# Altium schematic sheet 00Structure.SchDoc
size A3; SheetNumber: 0; SheetTotal: 1
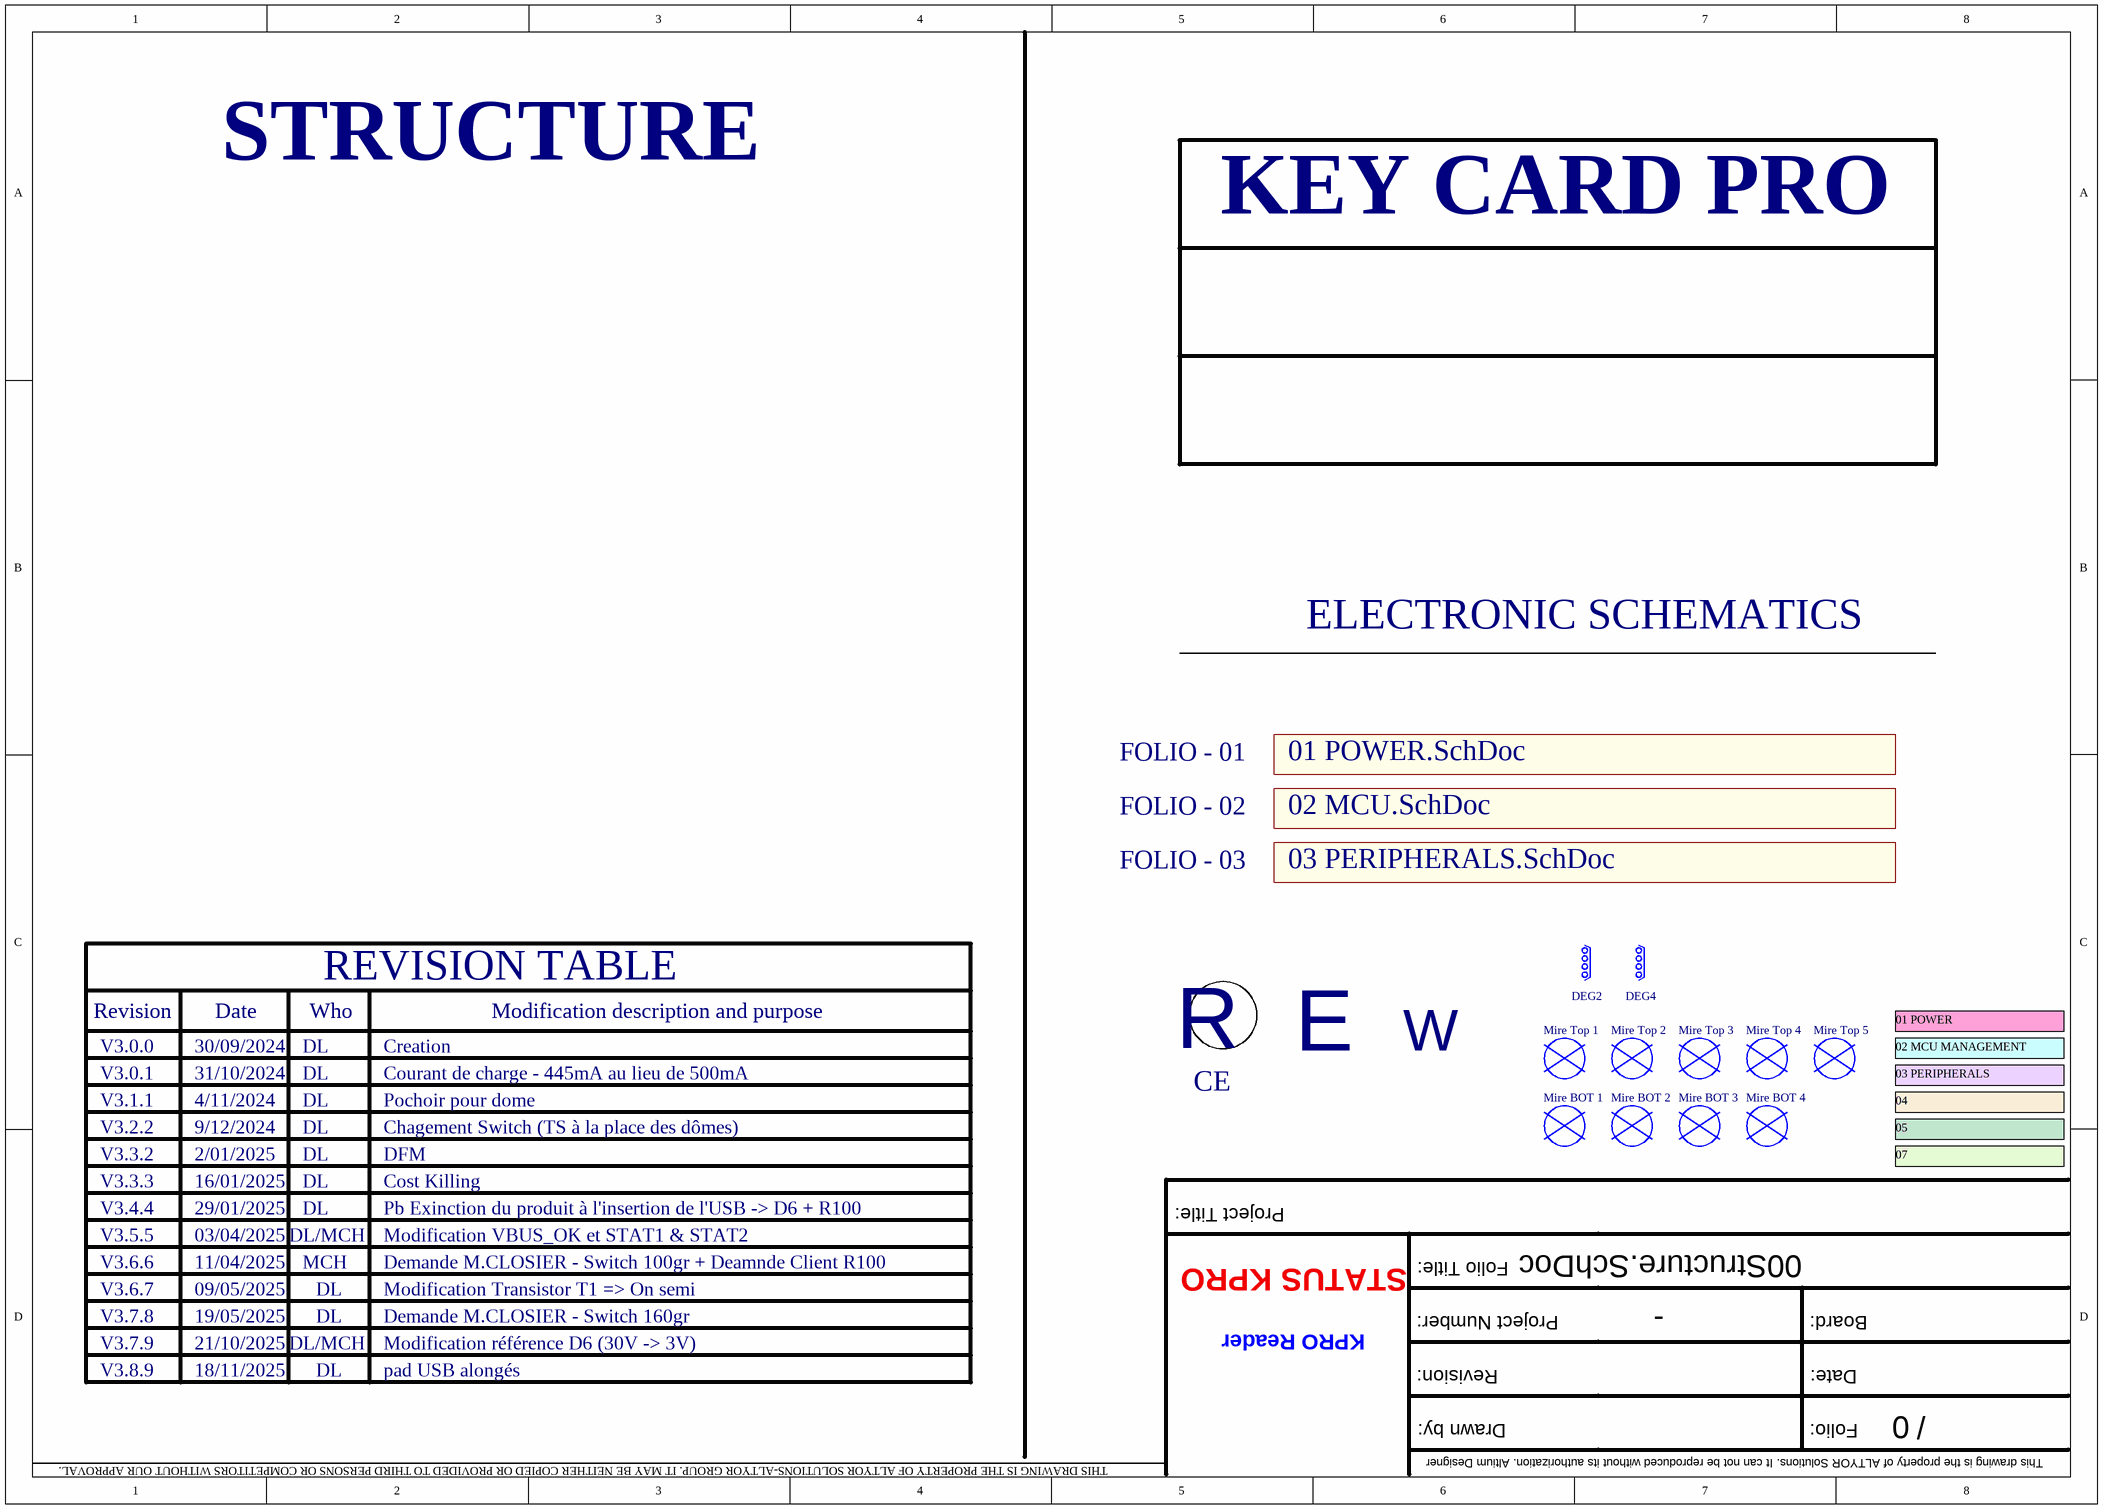
[diagram p0: 00Structure.SchDoc]

## Parts
DEG2  DNI  [DEGRAPAGE 4 x 0.5]  (value not drawn)  (no BOM)
DEG4  DNI  [DEGRAPAGE 4 x 0.5]  (value not drawn)  (no BOM)
ESD  ESD  [LOGO_ESD_OVERLAY]  (value not drawn)  (no BOM)
LOGO_CE  LOGO CE  [LOGO_CE]  (value not drawn)  (no BOM)
Mire_BOT_1  DNI  [MIRE]  (value not drawn)
Mire_BOT_2  DNI  [MIRE]  (value not drawn)
Mire_BOT_3  DNI  [MIRE]  (value not drawn)
Mire_BOT_4  DNI  [MIRE]  (value not drawn)
Mire_Top_1  DNI  [MIRE]  (value not drawn)
Mire_Top_2  DNI  [MIRE]  (value not drawn)
Mire_Top_3  DNI  [MIRE]  (value not drawn)
Mire_Top_4  DNI  [MIRE]  (value not drawn)
Mire_Top_5  DNI  [MIRE]  (value not drawn)
RoHS  (no value)  [LOGO_ROHS_OVERLAY]  (no BOM)
WEEE  WEEE  [LOGO_WEEE_OVERLAY]  (value not drawn)  (no BOM)

## Sub-sheets
FOLIO - 01 = 01 POWER.SchDoc: no entries
FOLIO - 02 = 02 MCU.SchDoc: no entries
FOLIO - 03 = 03 PERIPHERALS.SchDoc: no entries

## Notes on the sheet
- STRUCTURE
- KEY CARD PRO
- ELECTRONIC SCHEMATICS
- REVISION TABLE
- Revision
- V3.0.0
- 30/09/2024
- Date
- DL
- Who
- Creation
- Modification description and purpose
- 01 POWER
- 02 MCU MANAGEMENT
- V3.0.1
- V3.1.1
- 31/10/2024
- 4/11/2024
- Courant de charge - 445mA au lieu de 500mA
- Pochoir pour dome
- 03 PERIPHERALS
- 04
- V3.2.2
- V3.3.2
- V3.3.3
- 9/12/2024
- 2/01/2025
- 16/01/2025
- Chagement Switch (TS à la place des dômes)
- DFM
- Cost Killing
- 07
- 05
- V3.4.4
- V3.5.5
- 29/01/2025
- 03/04/2025
- DL/MCH
- Pb Exinction du produit à l'insertion de l'USB -> D6 + R100
- Modification VBUS_OK et STAT1 & STAT2
- V3.6.6
- V3.6.7
- V3.7.8
- 11/04/2025
- 09/05/2025
- 19/05/2025
- MCH
- Modification Transistor T1 => On semi
- Demande M.CLOSIER - Switch 100gr + Deamnde Client R100
- Demande M.CLOSIER - Switch 160gr
- V3.7.9
- V3.8.9
- 21/10/2025
- 18/11/2025
- Modification référence D6 (30V -> 3V)
- pad USB alongés
- STATUS KPRO
- Project Title:
- Folio Title:
- KPRO Reader
- Project Number:
- -
- Board:
- Revision:
- Date:
- THIS DRAWING IS THE PROPERTY OF ALTYOR SOLUTIONS-ALTYOR GROUP. IT MAY BE NEITHER COPIED OR PROVIDED TO THIRD PERSONS OR COMPETITORS WITHOUT OUR APPROVAL.
- Drawn by:
- Folio:
- /
- This drawing is the property of ALTYOR Solutions. It can not be reproduced without its authorization. Altium Designer
- (in symbol ESD) E
- (in symbol RoHS) R
- (in symbol WEEE) W

## Library data of the parts
DEG2 DEG4 = DEGRAP: Dégrapage (Breakout Tab); ERP CODE: 10-*; ERP SF CODE: 16; GENERIC: False; TMAX: N/A; TMIN: N/A; NAME: DEGRAP
ESD = ESD: ESD Logo; MANUFACTURER: Europa; ERP CODE: 10-*; GENERIC: False; ARTICLE CODE: *; ERP SF CODE: *; PRICE: *; MANUFACTURE_CND: *; TMAX: *; TMIN: *
LOGO_CE = LOGO CE: ESD Logo; MANUFACTURER: Europa; ERP CODE: 10-*; GENERIC: False; LIBRARY REFERENCE: CE; ARTICLE CODE: *; ERP SF CODE: *; PRICE: *; MANUFACTURE_CND: *; TMAX: *; TMIN: *
Mire_BOT_1-Mire_BOT_4 Mire_Top_1-Mire_Top_5 = Mire: NAME: DNI
RoHS = RoHS: RoHS Logo; MANUFACTURER: Europa; ERP CODE: 10-*; GENERIC: False; ARTICLE CODE: *; ERP SF CODE: *; PRICE: *; MANUFACTURE_CND: *; REFERENCE: RoHS; TMAX: *; TMIN: *
WEEE = WEEE: WEEE Logo; MANUFACTURER: Europa; ERP CODE: 10-*; GENERIC: False; ARTICLE CODE: *; ERP SF CODE: *; PRICE: *; MANUFACTURE_CND: *; TMAX: *; TMIN: *